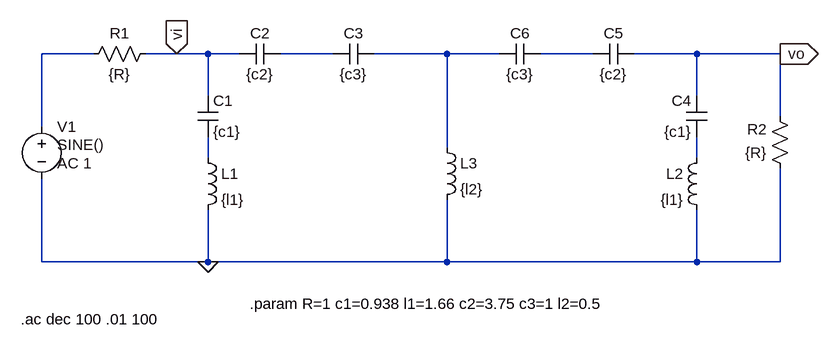
[diagram p0: schematic ts15.asc]
ts15.asc, the LTspice schematic file:
Version 4
SHEET 1 1192 680
WIRE 48 32 -32 32
WIRE 176 32 128 32
WIRE 224 32 176 32
WIRE 272 32 224 32
WIRE 416 32 336 32
WIRE 592 32 480 32
WIRE 672 32 592 32
WIRE 816 32 736 32
WIRE 976 32 880 32
WIRE 1104 32 976 32
WIRE 224 96 224 32
WIRE 976 96 976 32
WIRE 1104 128 1104 32
WIRE -32 144 -32 32
WIRE 592 176 592 32
WIRE 224 192 224 160
WIRE 976 192 976 160
WIRE -32 352 -32 224
WIRE 224 352 224 272
WIRE 224 352 -32 352
WIRE 592 352 592 256
WIRE 592 352 224 352
WIRE 976 352 976 272
WIRE 976 352 592 352
WIRE 1104 352 1104 208
WIRE 1104 352 976 352
FLAG 224 352 0
FLAG 176 32 vi
IOPIN 176 32 In
FLAG 1104 32 vo
IOPIN 1104 32 Out
SYMBOL voltage -32 128 R0
WINDOW 3 24 44 Left 2
WINDOW 123 24 72 Left 2
WINDOW 39 0 0 Left 0
SYMATTR Value SINE()
SYMATTR Value2 AC 1
SYMATTR InstName V1
SYMBOL res 144 16 R90
WINDOW 0 0 56 VBottom 2
WINDOW 3 32 56 VTop 2
SYMATTR InstName R1
SYMATTR Value {R}
SYMBOL res 1120 224 R180
WINDOW 0 36 76 Left 2
WINDOW 3 36 40 Left 2
SYMATTR InstName R2
SYMATTR Value {R}
SYMBOL ind 208 176 R0
SYMATTR InstName L1
SYMATTR Value {l1}
SYMBOL cap 208 96 R0
SYMATTR InstName C1
SYMATTR Value {c1}
SYMBOL cap 336 16 R90
WINDOW 0 0 32 VBottom 2
WINDOW 3 32 32 VTop 2
SYMATTR InstName C2
SYMATTR Value {c2}
SYMBOL cap 480 16 R90
WINDOW 0 0 32 VBottom 2
WINDOW 3 32 32 VTop 2
SYMATTR InstName C3
SYMATTR Value {c3}
SYMBOL ind 992 176 M0
SYMATTR InstName L2
SYMATTR Value {l1}
SYMBOL cap 992 96 M0
SYMATTR InstName C4
SYMATTR Value {c1}
SYMBOL cap 816 16 M90
WINDOW 0 0 32 VBottom 2
WINDOW 3 32 32 VTop 2
SYMATTR InstName C5
SYMATTR Value {c2}
SYMBOL cap 736 16 R90
WINDOW 0 0 32 VBottom 2
WINDOW 3 32 32 VTop 2
SYMATTR InstName C6
SYMATTR Value {c3}
SYMBOL ind 576 160 R0
SYMATTR InstName L3
SYMATTR Value {l2}
TEXT 288 416 Left 2 !.param R=1 c1=0.938 l1=1.66 c2=3.75 c3=1 l2=0.5
TEXT -64 440 Left 2 !.ac dec 100 .01 100

The netlist it stands for:
* ts15.asc
V1 N001 0 SINE() AC 1
R1 vi N001 {R}
R2 0 vo {R}
L1 N005 0 {l1}
C1 vi N005 {c1}
C2 N002 vi {c2}
C3 N003 N002 {c3}
L2 N006 0 {l1}
C4 vo N006 {c1}
C5 N004 vo {c2}
C6 N004 N003 {c3}
L3 N003 0 {l2}
.param R=1 c1=0.938 l1=1.66 c2=3.75 c3=1 l2=0.5
.ac dec 100 .01 100
.backanno
.end